# Altium schematic sheet power.SchDoc
size A
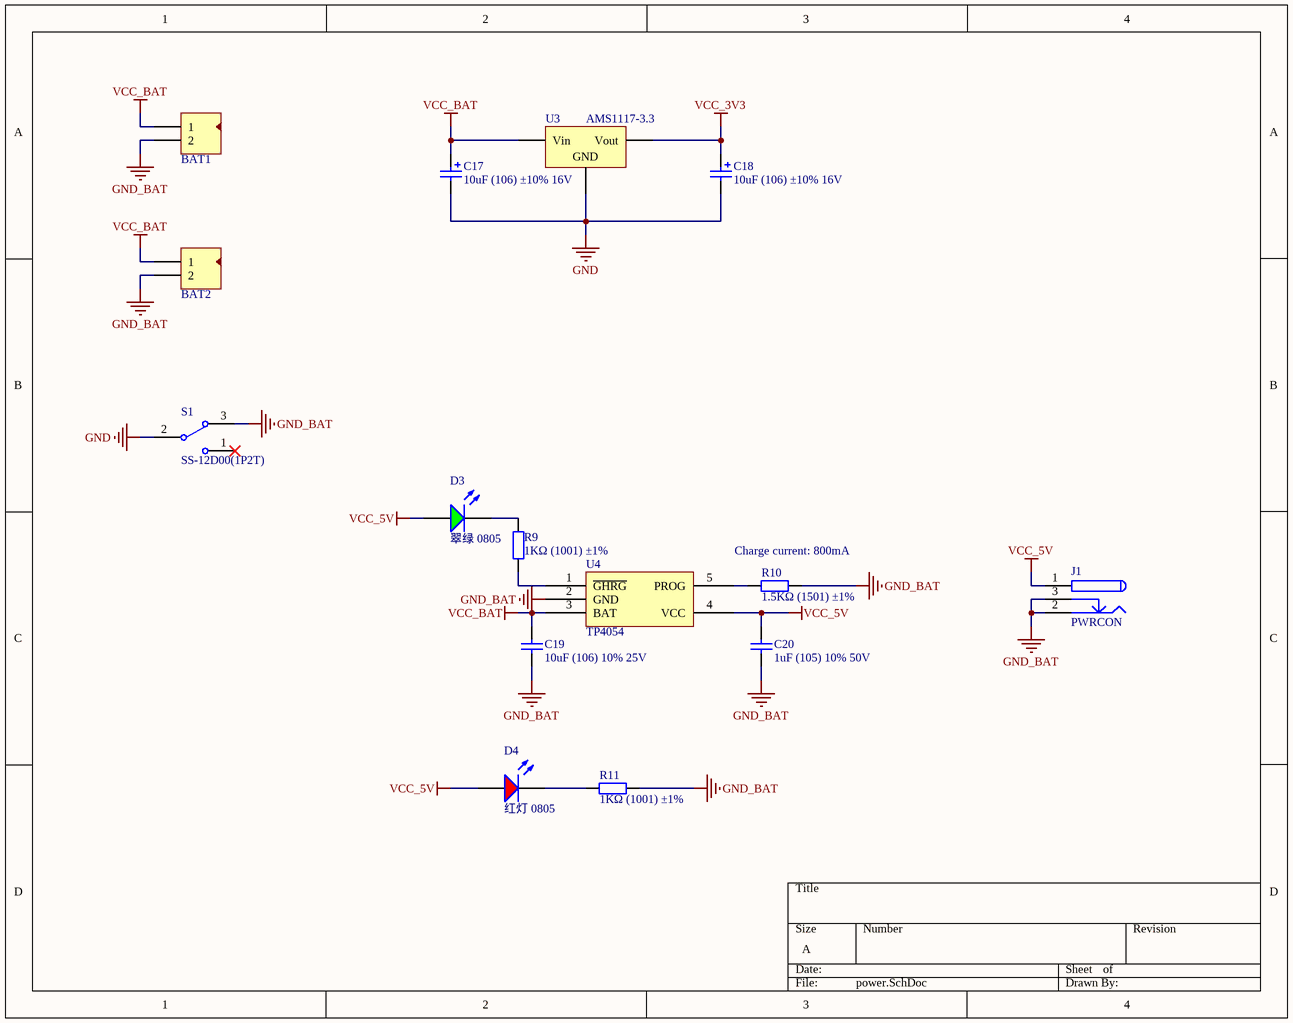
[diagram p0: power.SchDoc]

## Parts
C17  10uF (106) ±10% 16V  [LC-CASE-A_3216]
C18  10uF (106) ±10% 16V  [LC-CASE-A_3216]
C19  10uF (106) 10% 25V  [LC-0805_C]
C20  1uF (105) 10% 50V  [LC-0805_C]
D3  翠绿 0805  [LC-0805_LED_S1]
D4  红灯 0805  [LC-0805_LED_S1]
J1  PWRCON  [DC-005]
P8  BAT1  [HDR2X1-2.54]
P9  BAT2  [HDR2X1-2.54]
R9  1KΩ (1001) ±1%  [LC-0805_R]
R10  1.5KΩ (1501) ±1%  [LC-0805_R]
R11  1KΩ (1001) ±1%  [LC-0805_R]
S1  SS-12D00(1P2T)  [XH2.54-3P]
U3  AMS1117-3.3  [LC-SOT-223]
U4  TP4054  [LC-SOT-23-5]

## Nets
GND: C17.2 C18.2 S1.2 U3.1(GND)
GND_BAT: C19.1 C20.1 J1.2 J1.3 P8.2 P9.2 R10.2 R11.1 S1.3 U4.2(GND)
VCC_3V3: C18.1 U3.2(Vout)
VCC_5V: C20.2 D3.A D4.A J1.1 U4.4(VCC)
VCC_BAT: C17.1 C19.2 P8.1 P9.1 U3.3(Vin) U4.3(BAT)
NetD3_K: D3.K R9.2
NetD4_K: D4.K R11.2
NetR9_1: R9.1 U4.1(~{GHRG})
NetR10_1: R10.1 U4.5(PROG)

Not connected (* = marked no-connect by the designer): S1 1*

## Notes on the sheet
- (near R10) Charge current: 800mA

## Library data of the parts
C17 C18 = 3216 10uF (106) 10% 16V: 钽电容; ComponentLink1Description: 供应商链接; ComponentLink1URL: http://www.szlcsc.com/product/details_7643.html; Package: 3216; Supplier: LC; SuppliersPartNumber: C7171
C19 = 0805 10uF (106) 10% 25V: 贴片电容; ComponentLink1Description: 供应商链接; ComponentLink1URL: http://www.szlcsc.com/product/details_16532.html; Package: 0805; Supplier: LC; SuppliersPartNumber: C15850
C20 = 0805 1uF (105) 10% 50V: 贴片电容; ComponentLink1Description: 供应商链接; ComponentLink1URL: http://www.szlcsc.com/product/details_29074.html; Package: 0805; Supplier: LC; SuppliersPartNumber: C28323
D3 = 0805 翠绿: 发光二极管; ComponentLink1Description: 供应商链接; ComponentLink1URL: http://www.szlcsc.com/product/details_2670.html; Package: 0805; Supplier: LC; SuppliersPartNumber: C2297
D4 = 0805 红灯: 发光二极管; ComponentLink1Description: 供应商链接; ComponentLink1URL: http://www.szlcsc.com/product/details_2668.html; Package: 0805; Supplier: LC; SuppliersPartNumber: C2295
J1 = PWRCON: 直流电源端子; Published: 17-Dec-2003; DatasheetDocument: 09-May-2002; Publisher: Altium Limited; ComponentLink1Description: Manufacturer Link; ComponentLink1URL: http://domino.kycon.com/internet/Products.html
P8 P9 = Header 2: 接插件; LatestRevisionDate: 17-Jul-2002; LatestRevisionNote: Re-released for DXP Platform.; Publisher: Altium Limited
R9 R11 = 0805 1KΩ (1001) 1%: 贴片电阻; ComponentLink1Description: 供应商链接; ComponentLink1URL: http://www.szlcsc.com/product/details_18201.html; Package: 0805; Supplier: LC; SuppliersPartNumber: C17513
R10 = 0805 1.5KΩ (1501) 1%: 贴片电阻; ComponentLink1Description: 供应商链接; ComponentLink1URL: http://www.szlcsc.com/product/details_4717.html; Package: 0805; Supplier: LC; SuppliersPartNumber: C4310
S1 = SW-SPDT: 开关; Published: 24-Mar-1999; LatestRevisionDate: 17-Dec-2003; LatestRevisionNote: Schematic revised, PCB Footprint replaced.; DatasheetDocument: 05-Dec-2000; PackageReference: TL36WW15050; Publisher: Altium Limited; ComponentLink1Description: Manufacturer Link; ComponentLink1URL: http://www.apem.com
U3 = SOT-223 AMS1117-3.3: 低压差线性稳压(LDO); ComponentLink1Description: 供应商链接; ComponentLink1URL: http://www.szlcsc.com/product/details_6652.html; Package: SOT-223; Supplier: LC; SuppliersPartNumber: C6186
U4 = TP4054: 电池电源管理; ComponentLink1Description: 供应商链接; ComponentLink1URL: http://www.szlcsc.com/product/details_33539.html; Package: SOT-23-5; Supplier: LC; SuppliersPartNumber: C32574